# Altium schematic sheet 01_Panel.SchDoc
size A4
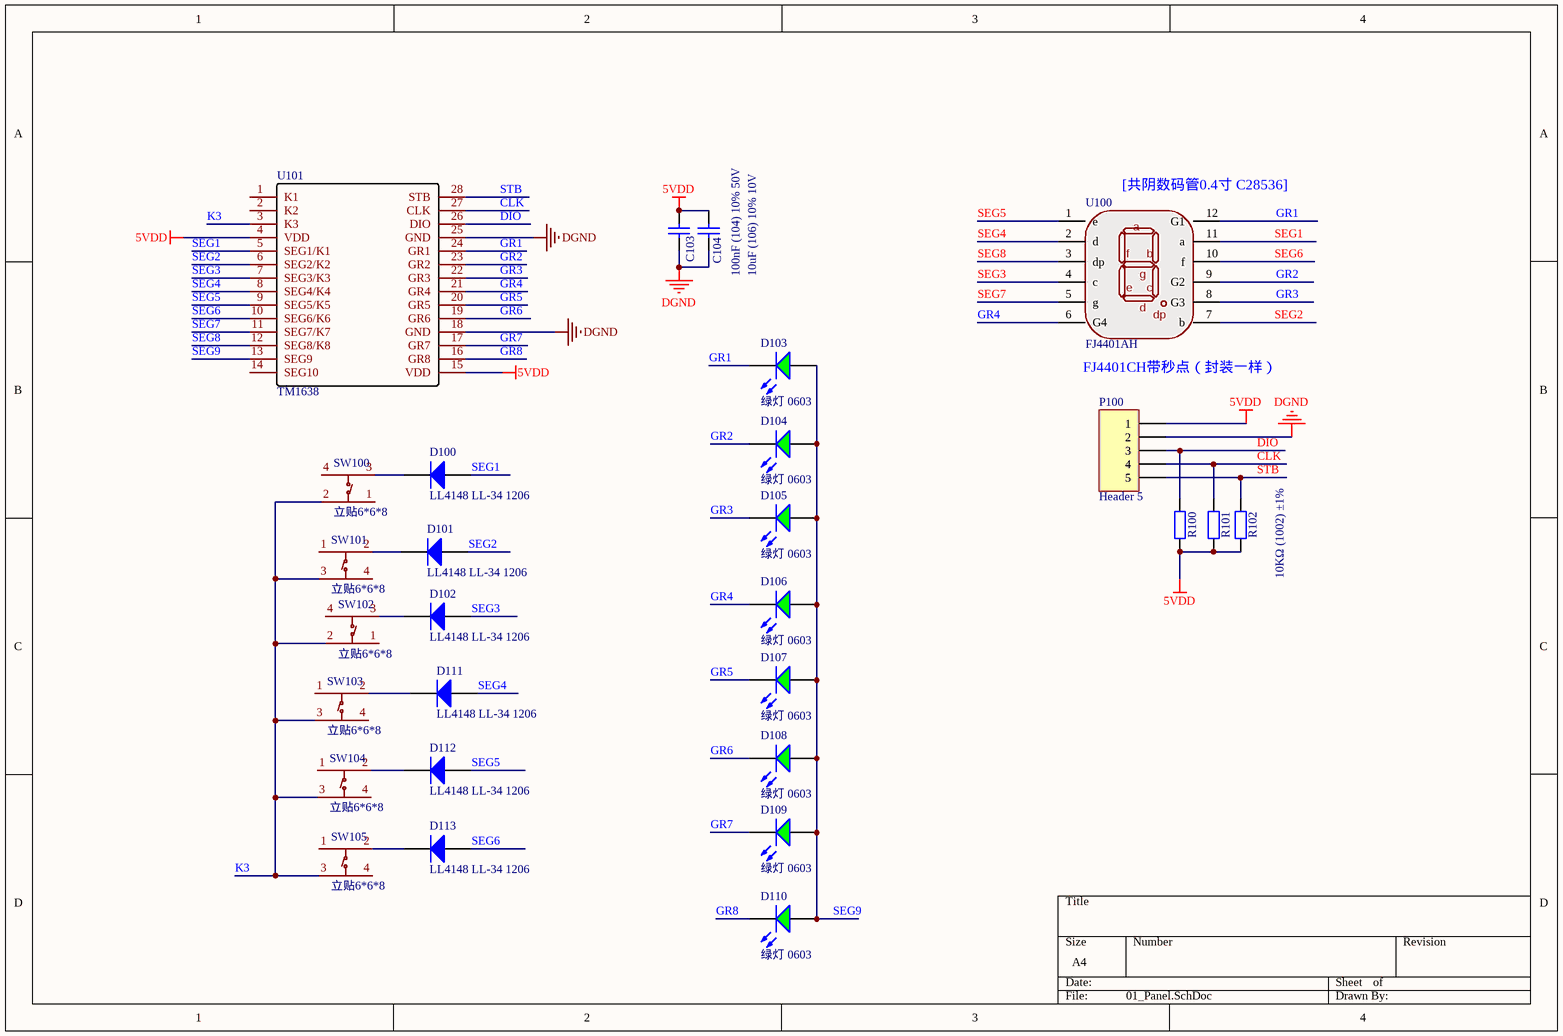
[diagram p0: 01_Panel.SchDoc]

## Parts
C103  10uF (106) 10% 10V  [0603_C]
C104  100nF (104) 10% 50V  [0603_C]
D100  LL4148 LL-34 1206  [LL-34]
D101  LL4148 LL-34 1206  [LL-34]
D102  LL4148 LL-34 1206  [LL-34]
D103  绿灯 0603  [LED插件--3mm]
D104  绿灯 0603  [LED插件--3mm]
D105  绿灯 0603  [LED插件--3mm]
D106  绿灯 0603  [LED插件--3mm]
D107  绿灯 0603  [LED插件--3mm]
D108  绿灯 0603  [LED插件--3mm]
D109  绿灯 0603  [LED插件--3mm]
D110  绿灯 0603  [LED插件--3mm]
D111  LL4148 LL-34 1206  [LL-34]
D112  LL4148 LL-34 1206  [LL-34]
D113  LL4148 LL-34 1206  [LL-34]
P100  Header 5  [XH2.54-5P]
R100  10KΩ (1002) ±1%  [0603_R]  (value not drawn)
R101  10KΩ (1002) ±1%  [0603_R]  (value not drawn)
R102  10KΩ (1002) ±1%  [0603_R]
SW100  立贴6*6*8  [SW]
SW101  立贴6*6*8  [SW]
SW102  立贴6*6*8  [SW]
SW103  立贴6*6*8  [SW]
SW104  立贴6*6*8  [SW]
SW105  立贴6*6*8  [SW]
U100  FJ4401AH  [Digital_0.4]
U101  TM1638  [TM1638]

## Nets
5VDD: C103.2 C104.2 P100.1 R100.1 R101.1 R102.1 U101.4(VDD) U101.15(VDD)
DGND: C103.1 C104.1 P100.2 U101.18(GND) U101.25(GND)
CLK: P100.4 R101.2 U101.27(CLK)
DIO: P100.3 R100.2 U101.26(DIO)
GR1: D103.K U100.12(G1) U101.24(GR1)
GR2: D104.K U100.9(G2) U101.23(GR2)
GR3: D105.K U100.8(G3) U101.22(GR3)
GR4: D106.K U100.6(G4) U101.21(GR4)
GR5: D107.K U101.20(GR5)
GR6: D108.K U101.19(GR6)
GR7: D109.K U101.17(GR7)
GR8: D110.K U101.16(GR8)
K3: SW100.2 SW101.3 SW102.2 SW103.3 SW104.3 SW105.3 U101.3(K3)
SEG1: D100.1(A) U100.11(a) U101.5(SEG1/K1)
SEG2: D101.1(A) U100.7(b) U101.6(SEG2/K2)
SEG3: D102.1(A) U100.4(c) U101.7(SEG3/K3)
SEG4: D111.1(A) U100.2(d) U101.8(SEG4/K4)
SEG5: D112.1(A) U100.1(e) U101.9(SEG5/K5)
SEG6: D113.1(A) U100.10(f) U101.10(SEG6/K6)
SEG7: U100.5(g) U101.11(SEG7/K7)
SEG8: U100.3(dp) U101.12(SEG8/K8)
SEG9: D103.A D104.A D105.A D106.A D107.A D108.A D109.A D110.A U101.13(SEG9)
STB: P100.5 R102.2 U101.28(STB)
NetD100_2: D100.2(K) SW100.3
NetD101_2: D101.2(K) SW101.2
NetD102_2: D102.2(K) SW102.3
NetD111_2: D111.2(K) SW103.2
NetD112_2: D112.2(K) SW104.2
NetD113_2: D113.2(K) SW105.2

Not connected (* = marked no-connect by the designer): SW100 1 4; SW101 1 4; SW102 1 4; SW103 1 4; SW104 1 4; SW105 1 4; U101 1(K1) 2(K2) 14(SEG10)

## Notes on the sheet
- (near U100) [共阴数码管0.4寸 C28536]
- FJ4401CH带秒点（封装一样）

## Library data of the parts
C103 = 0603 10uF (106) 10% 10V: 贴片电容; ComponentLink1Description: 供应商链接; ComponentLink1URL: http://www.szlcsc.com/product/details_20411.html; Package: 0603; Supplier: LC; SuppliersPartNumber: C19702
C104 = 0603 100nF (104) 10% 50V: 贴片电容; ComponentLink1Description: 供应商链接; ComponentLink1URL: http://www.szlcsc.com/product/details_15331.html; Package: 0603; Supplier: LC; SuppliersPartNumber: C14663
D100-D102 D111-D113 = LL-34 LL4148 LL-34 1206: 开关二极管; ComponentLink1Description: 供应商链接; ComponentLink1URL: http://www.szlcsc.com/product/details_10338.html; Package: LL-34; Supplier: LC; SuppliersPartNumber: C9808
D103-D110 = 0603 绿灯: 发光二极管; ComponentLink1Description: 供应商链接; ComponentLink1URL: http://www.szlcsc.com/product/details_73152.html; Package: 0603; Supplier: LC; SuppliersPartNumber: C72043
P100 = Header 5: Header, 5-Pin; LatestRevisionDate: 17-Jul-2002; LatestRevisionNote: Re-released for DXP Platform.; Publisher: Altium Limited
R100-R102 = 0603 10KΩ (1002) 1%: 贴片电阻; ComponentLink1Description: 供应商链接; ComponentLink1URL: http://www.szlcsc.com/product/details_26547.html; Package: 0603; Supplier: LC; SuppliersPartNumber: C25804
SW100-SW105 = SW
U100 = Digital_0.4